# Altium schematic sheet Sound Board.SchDoc
size A
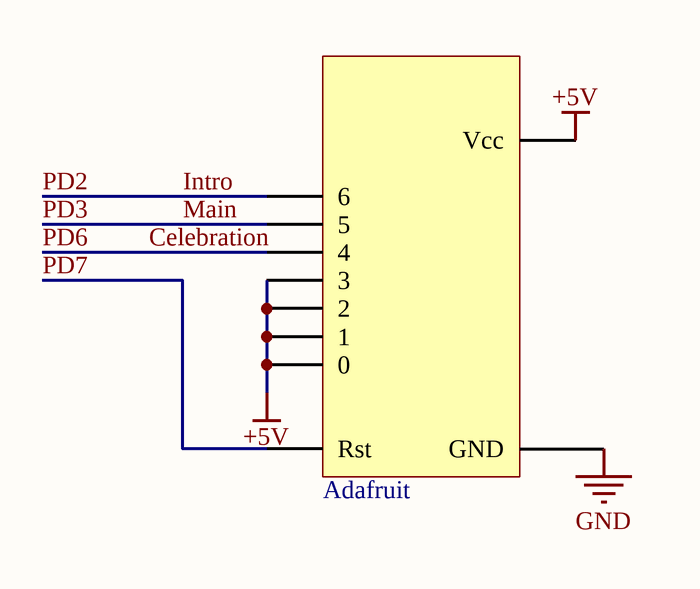
[diagram p0: Sound Board.SchDoc]

## Parts
A1  Adafruit  [DIP-16/X1.5]

## Nets
+5V: A1.1(0) A1.2(1) A1.3(2) A1.4(3) A1.14(Vcc)
GND: A1.0(GND)
Celebration: A1.5(4)  [also labelled PD6]
Intro: A1.7(6)  [also labelled PD2]
Main: A1.6(5)  [also labelled PD3]
PD7: A1.16(Rst)

## Library data of the parts
A1 = 74xxx595: 8-Bit Serial-Input/Serial or Prallel-Output Shift Register with Latched 3-State Outputs; Manufacturer: ON Semiconductor; Class: Logic; Published: 15/04/2002; Publisher: Altium Hobart Technology Centre; SubClass: Register